# Altium schematic sheet [04]EEPROM_FLASH.SchDoc
size A4
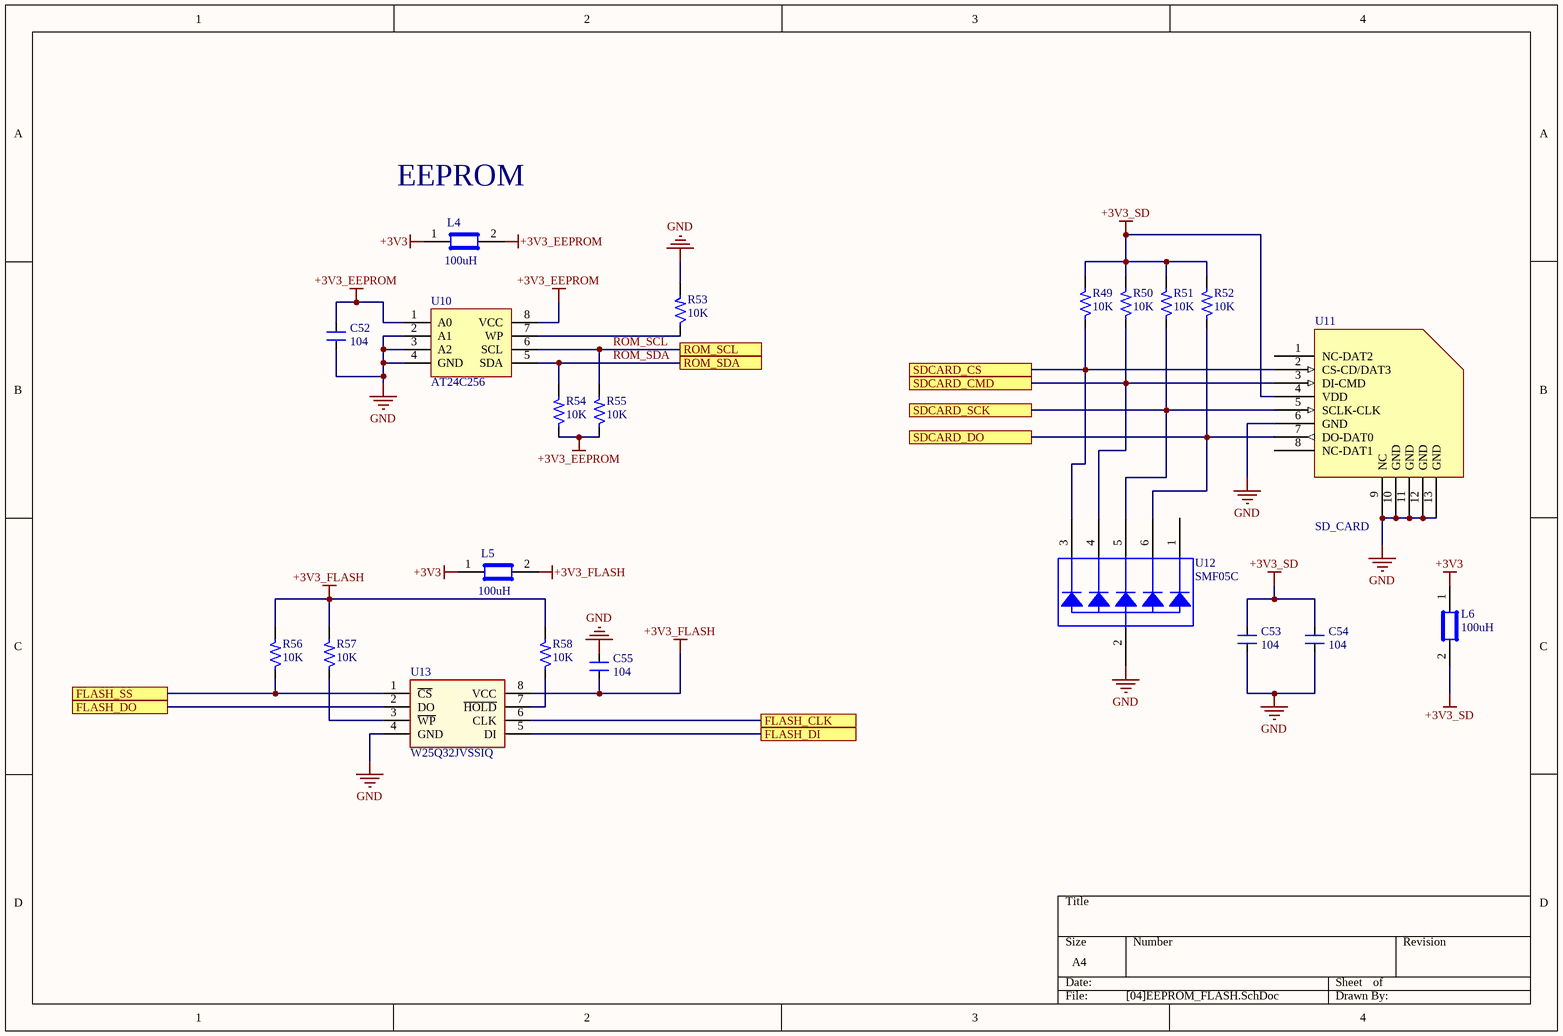
[diagram p0: [04]EEPROM_FLASH.SchDoc]

## Parts
C52  104  [C0603 SMT]
C53  104  [C0603 SMT]
C54  104  [C0603 SMT]
C55  104  [C0603 SMT]
L4  100uH  [R0805]
L5  100uH  [R0805]
L6  100uH  [R0805]
R49  10K  [R0603 -SMT]
R50  10K  [R0603 -SMT]
R51  10K  [R0603 -SMT]
R52  10K  [R0603 -SMT]
R53  10K  [R0603 -SMT]
R54  10K  [R0603 -SMT]
R55  10K  [R0603 -SMT]
R56  10K  [R0603 -SMT]
R57  10K  [R0603 -SMT]
R58  10K  [R0603 -SMT]
U10  AT24C256  [SO-8]
U11  SD_CARD  [MICROSD2]
U12  SMF05C  [SOT_363_6]
U13  W25Q32JVSSIQ  [SO-8 208]

## Ports
FLASH_CLK, FLASH_DI, FLASH_DO, FLASH_SS, ROM_SCL, ROM_SDA, SDCARD_CMD, SDCARD_CS, SDCARD_DO, SDCARD_SCK

## Nets
+3V3: L4.1 L5.1 L6.1
+3V3_EEPROM: C52.2 L4.2 R54.1 R55.1 U10.1(A0) U10.8(VCC)
+3V3_FLASH: C55.1 L5.2 R56.2 R57.2 R58.2 U13.8(VCC)
+3V3_SD: C53.2 C54.2 L6.2 R49.2 R50.2 R51.2 R52.2 U11.4(VDD)
GND: C52.1 C53.1 C54.1 C55.2 R53.2 U10.2(A1) U10.3(A2) U10.4(GND) U11.6(GND) U11.9(NC) U11.10(GND) U11.11(GND) U11.12(GND) U11.13(GND) U12.2(A) U13.4(GND)
FLASH_CLK: U13.6(CLK) ; port FLASH_CLK
FLASH_DI: U13.5(DI) ; port FLASH_DI
FLASH_DO: U13.2(DO) ; port FLASH_DO
FLASH_SS: R56.1 U13.1(~{CS}) ; port FLASH_SS
ROM_SCL: R55.2 U10.6(SCL) ; port ROM_SCL
ROM_SDA: R54.2 U10.5(SDA) ; port ROM_SDA
SDCARD_CMD: R50.1 U11.3(DI-CMD) U12.4(K3) ; port SDCARD_CMD
SDCARD_CS: R49.1 U11.2(CS-CD/DAT3) U12.3(K2) ; port SDCARD_CS
SDCARD_DO: R52.1 U11.7(DO-DAT0) U12.6(K5) ; port SDCARD_DO
SDCARD_SCK: R51.1 U11.5(SCLK-CLK) U12.5(K4) ; port SDCARD_SCK
NetR53_1: R53.1 U10.7(WP)
NetR57_1: R57.1 U13.3(~{WP})
NetR58_1: R58.1 U13.7(~{HOLD})

Not connected (* = marked no-connect by the designer): U11 1(NC-DAT2) 8(NC-DAT1); U12 1(K1)

## Notes on the sheet
- (near L4) EEPROM

## Library data of the parts
C52-C55 = CM: Cap SMD; Value: 103
L4-L6 = Ferrite Bead: 100uH 0805
R49-R58 = RM: Resistor SMD; Value: 1K
U10 = AT24Cxx
U11 = MicroSD: SD/MMC holder; Name: SD/MMC; Price: 10000
U12 = SMF05C: ESD Protection
U13 = W25Q32JV: FLASH 32MBIT 133MHZ 8SOP